# EAGLE design ict_v361-xs (EAGLE 9.6.2)
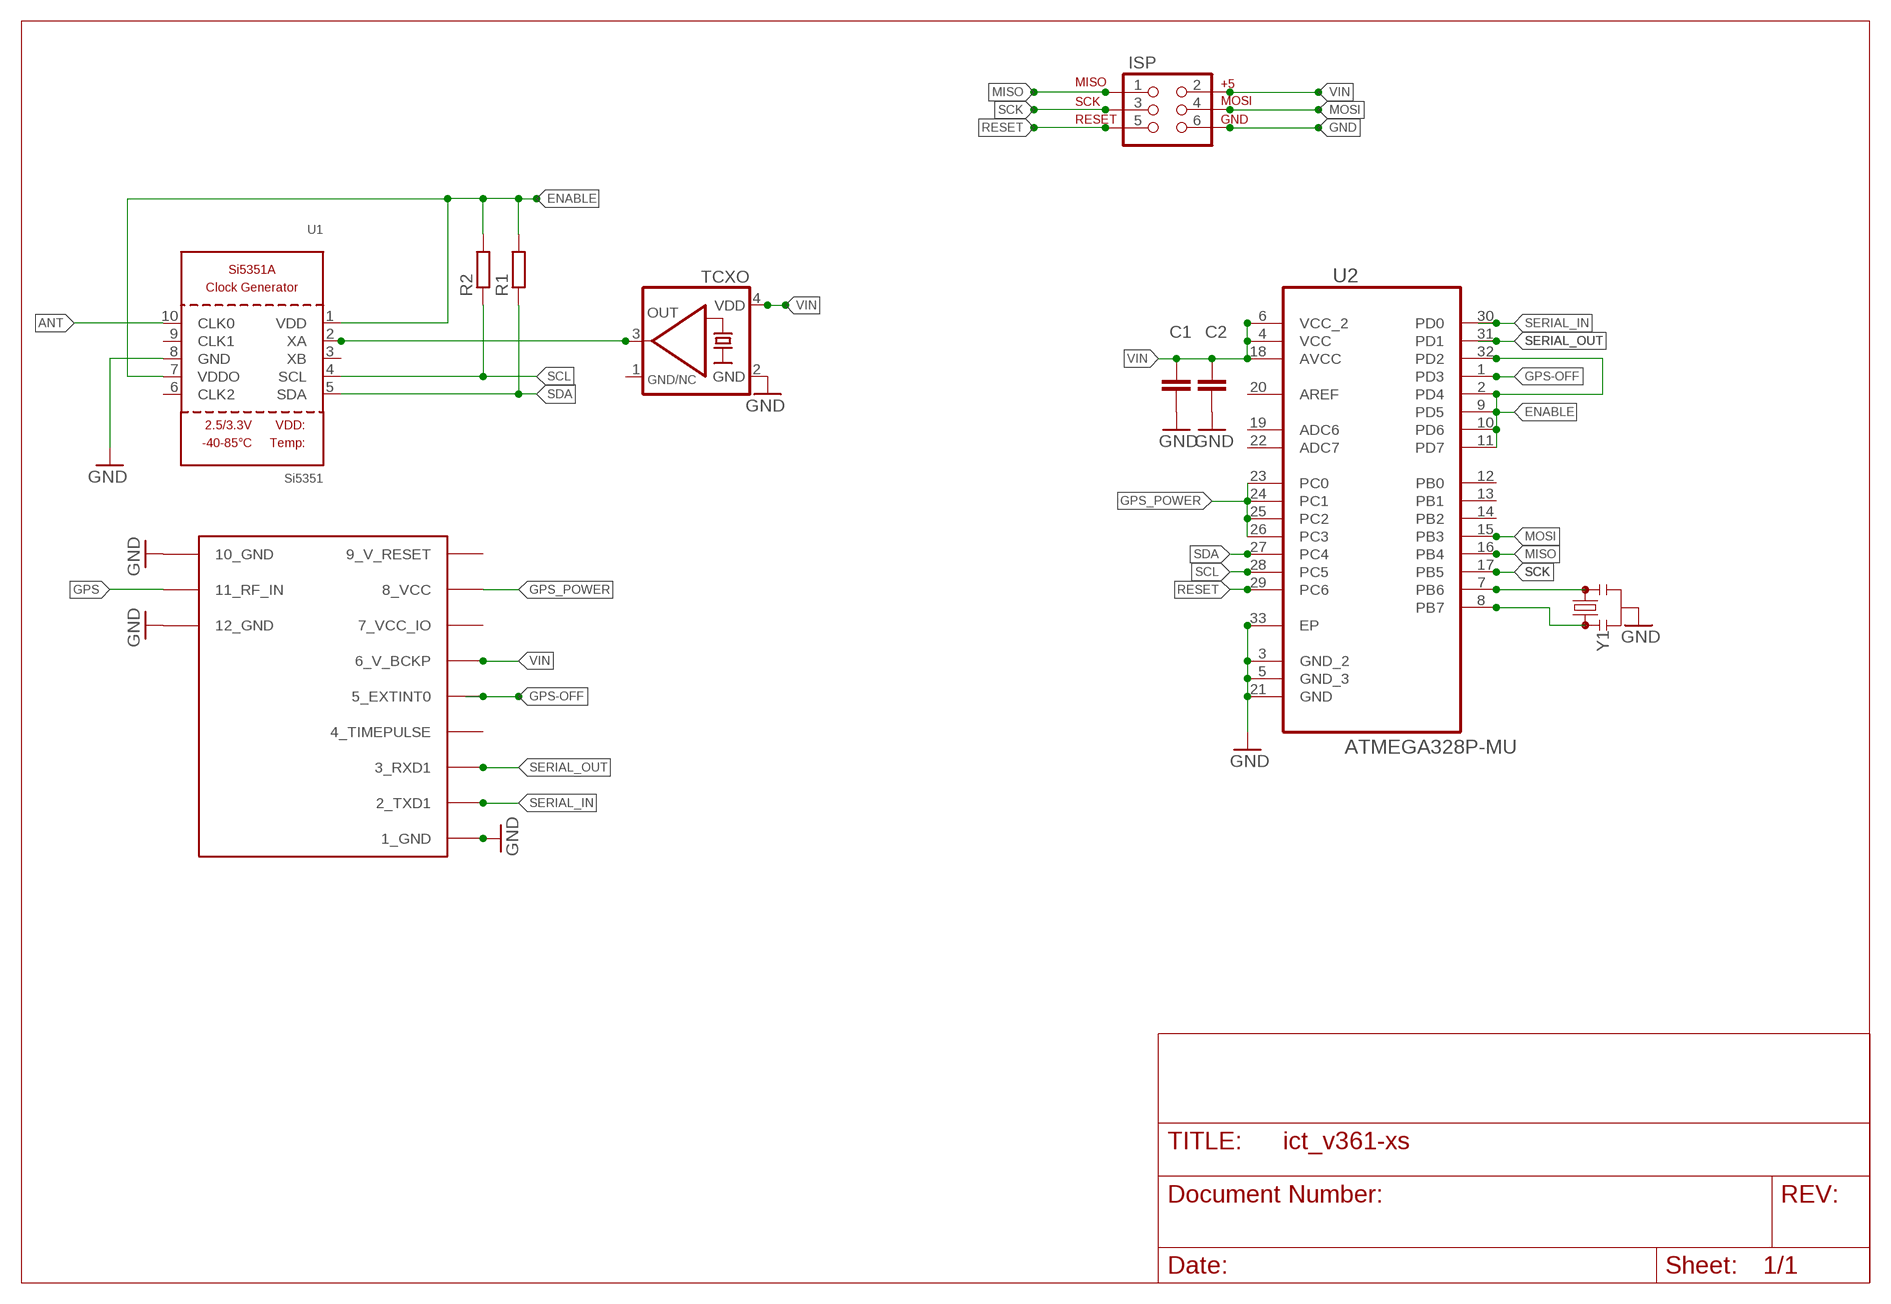
[diagram p0: schematic, sheet 1]

## Parts
C1  C-EUC0603K  [C0603K]
C2  C-EUC0603K  [C0603K]
GPS  UBLOX_MAX  [UBLOX_MAX]
ISP  AVR_SPI_PRG_6PTH  [2X3]
R1  R-EU_R0603  [R0603]
R2  R-EU_R0603  [R0603]
TCXO  KXO-TCXO-CMOS-84  [3.2X2.5_KXO-84-TCXO]
U1  Si5351  SI5351A  [MSOP10]
U2  ATMEGA328P-MU  [QFN50P500X500X100-33N]
Y1  RESONATORSMD-4.5X2.0  [RESONATOR-SMD-4.5X2.0]

## Nets
ANT: U1.10(CLK0)
ENABLE: R1.2 R2.2 U1.1(VDD) U1.7(VDDO) U2.2(PD4) U2.9(PD5) U2.10(PD6) U2.11(PD7) U2.32(PD2)
GND: C1.2 C2.2 GPS.1_GND GPS.10_GND GPS.12_GND ISP.6 TCXO.2(GND) U1.8(GND) U2.3(GND_2) U2.5(GND_3) U2.21(GND) U2.33(EP) Y1.2
GPS: GPS.11_RF_IN
GPS-OFF: GPS.5_EXTINT0 U2.1(PD3)
GPS_POWER: GPS.8_VCC U2.23(PC0) U2.24(PC1) U2.25(PC2) U2.26(PC3)
MISO: ISP.1 U2.16(PB4)
MOSI: ISP.4 U2.15(PB3)
N$1: U2.7(PB6) Y1.3
N$3: U2.8(PB7) Y1.1
N$19: TCXO.3(OUT) U1.2(XA)
RESET: ISP.5 U2.29(PC6)
SCK: ISP.3 U2.17(PB5)
SCL: R2.1 U1.4(SCL) U2.28(PC5)
SDA: R1.1 U1.5(SDA) U2.27(PC4)
SERIAL_IN: GPS.2_TXD1 U2.30(PD0)
SERIAL_OUT: GPS.3_RXD1 U2.31(PD1)
VIN: C1.1 C2.1 GPS.6_V_BCKP ISP.2 TCXO.4(VDD) U2.4(VCC) U2.6(VCC_2) U2.18(AVCC)
Unconnected: GPS.4_TIMEPULSE U1.3(XB) U1.6(CLK2) U1.9(CLK1) U2.12(PB0) U2.13(PB1) U2.14(PB2) U2.19(ADC6) U2.20(AREF) U2.22(ADC7)

## Power pins joined to a net without a drawn wire
7_VCC_IO: GPS.7_VCC_IO
9_V_RESET: GPS.9_V_RESET
GND/NC: TCXO.1(GND/NC)

## Library data of the parts
C1 C2 = rcl:C-EU: CAPACITOR, European symbol; SPICEPREFIX: C
GPS = Max gps:UBLOX_MAX: UBLOX MAX
ISP = SparkFun:AVR_SPI_PRG_6: AVR ISP 6 Pin This is the reduced ISP connector for AVR programming. Common on Arduino. This footprint will take up less PCB space and can be used with a 10-pin to 6-pin adapter such as SKU: BOB-08508
R1 R2 = resistor:R-EU_: RESISTOR, European symbol
TCXO = crystal-geyer_V1_0:KXO-TCXO-CMOS: TCXO : CMOS - Serie Model Size l/w/h [mm] Frequency Range Frequency Stability Temp. Range [°C] Output AECQ 200 availabel Datasheet KXO-86 KXO-84 KXO-83 KXO-82 2.5/2.0/0.7 3.2/2.5/1.0 5.0/3.2/1.5 7.0/5.0/2.4 13,0 ~ 40,0 MHz 10,0 ~ 40,0 MHz 10,0 ~ 40,0 MHz 10,0 ~ 30,0 MHz ±1,0 … ±2,5ppm ±1,0 … ±2,5ppm ±1,0 … ±3,0ppm ±1,0 … ±3,0ppm (*) -30°C …+75°C (*) -40°C …+85°C (*) -40°C …+85°C (*) -30°C …+80°C CMOS CMOS CMOS CMOS - - - - KXO-86.pdf <http://www.geyer-electronic.de/uploads/tx_userartikelfrequenz/GEYER-KXO-86-TCXO-HCMOS.pdf> KXO-84.pdf <http://www.geyer-electronic.de/uploads/tx_userartikelfrequenz/GEYER-KXO-84-TCXO-HCMOS.pdf> KXO-83.pdf <http://www.geyer-electronic.de/uploads/tx_userartikelfrequenz/GEYER-KXO-83-TCXO-HCMOS.pdf> KXO-82.pdf <http://www.geyer-electronic.de/uploads/tx_userartikelfrequenz/GEYER-KXO-82-TCXO-HCMOS.pdf> <http://www.geyer-electronic.de/fileadmin/template/img/logo-geyer-electronic.png> Details see: http://www.geyer-electronic.de/Frequenz-Produkte.9.0.html Created 2016-06-07, Hans Locher 2016 (C) Geyer Quartz Technology KXO86,KXO84,KXO83,KXO82;2550;3225;5032;7050;2,5x2,0;3,2x2,5;2.5x2.0;3.2x2.5,5,0x3,2;7,0x5,0,5.0x3.2,7.0x5.0
U1 = microbuilder:SI5351A: Si5351A 8kHz-160MHz I2C Clock Generator VDD: 2.5V or 3.3V Input Range: 25MHz or 27MHz XTAL User selectable internal input load capacitors: 6, 8 or 10 pF Output Impedance: 85 Ohm Output Load Capacitance: 5-15pF Operating Temperature: -40°C - 85°C Operating Current (3 outputs): 35mA Output buffer voltage (VDDO): 1.8, 2.5 or 3.3V Note: If VDDO is not used it should be connected to VDD. Unused clock out pins should be left floating.
U2 = ava:ATMEGA328P-MU: Programmable Flash; MPN: ATMEGA328P-MU; OC_FARNELL: 1748522; OC_NEWARK: 26R2526; PACKAGE: QFN-32; SUPPLIER: Atmel
Y1 = SparkFun-Clocks:RESONATOR: Resonators (Generic) Ceramic resonators are clock-generating components, often used to control timing in microcontrollers. They usually have 3 pins: two pins for oscillation, and one pin for ground. Compared to crystals, resonators have worse tolerance, but are usually much cheaper. Plus, they have built-in load capacitors! These devices are used on boards like the Arduino Pro 8MHz <https://www.sparkfun.com/products/11114> and Arduino Pro 16MHz <https://www.sparkfun.com/products/11113>.

## Net classes
0 default: width 0.203 mm
1 vcc: width 0.152 mm, clearance 0.152 mm

## Board
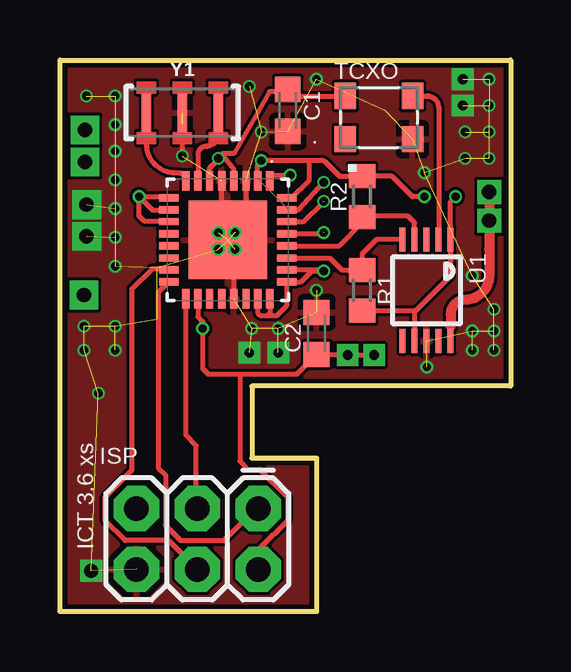
[diagram p1: board, top side]
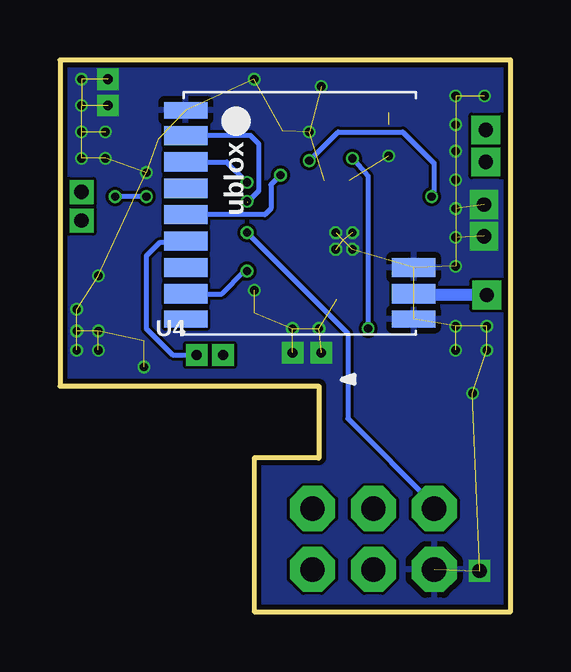
[diagram p2: board, bottom side, seen from below]

Size 18.8 x 23 mm. Coordinates in mm from the lower left corner, seen from the top.
Outline: 0,23 18.8,23 18.8,9.4 8,9.4 8,6.4 10.7,6.4 10.7,0 0,0 0,23
Copper layers (1*16): Top 0.035559375mm / dielectric 1.6mm / Bottom 0.035559375mm
Design rules "jlcpcb2layer *": minimum track width 5mil, minimum drill 12mil, track to track 5mil, track to pad 5mil, pad to pad 5mil, via to via 5mil, smd to smd 5mil, copper to edge 8mil, drill to drill 6mil, minimum pad ring 5mil, minimum via ring 3mil, stop-mask expansion 2.5mil, vias tented up to drill 14mil, thermal gap 10mil

### Footprints (pad centres in the part's own frame; a part is rotated, then mirrored left to right if it is on the bottom)
C0603K = smd 1.05 x 1.08: 1 -0.875,0; 2 0.875,0
UBLOX_MAX = smd 1.8 x 0.7: 1_GND 4.95,-4.4; 9_V_RESET 4.95,4.3; 10_GND -4.55,4.3 | smd 1.8 x 0.8: 2_TXD1 4.95,-3.35; 3_RXD1 4.95,-2.25; 4_TIMEPULSE 4.95,-1.15; 5_EXTINT0 4.95,-0.05; 6_V_BCKP 4.95,1.05; 7_VCC_IO 4.95,2.15; 8_VCC 4.95,3.25; 11_RF_IN -4.55,3.25; 12_GND -4.55,2.15
2X3 = drill 1.016 pad 1.88 octagon: 1 0,0; 2 0,2.54; 3 2.54,0; 4 2.54,2.54; 5 5.08,0; 6 5.08,2.54
R0603 = smd 1 x 1.1: 1 -0.85,0; 2 0.85,0
3.2X2.5_KXO-84-TCXO = smd 0.9 x 1.1: 1 -1.4,-0.9; 2 1.4,-0.9; 3 1.4,0.9; 4 -1.4,0.9
MSOP10 = smd 0.25 x 1: 1 -1,-2.113; 2 -0.5,-2.113; 3 0,-2.113; 4 0.5,-2.113; 5 1,-2.113; 6 1,2.113; 7 0.5,2.113; 8 0,2.113; 9 -0.5,2.113; 10 -1,2.113
QFN50P500X500X100-33N = smd 0.813 x 0.305: 1 -2.464,1.753; 2 -2.464,1.245; 3 -2.464,0.762; 4 -2.464,0.254; 5 -2.464,-0.254; 6 -2.464,-0.762; 7 -2.464,-1.245; 8 -2.464,-1.753; 17 2.464,-1.753; 18 2.464,-1.245; 19 2.464,-0.762; 20 2.464,-0.254; 21 2.464,0.254; 22 2.464,0.762; 23 2.464,1.245; 24 2.464,1.753 | smd 0.305 x 0.813: 9 -1.753,-2.464; 10 -1.245,-2.464; 11 -0.762,-2.464; 12 -0.254,-2.464; 13 0.254,-2.464; 14 0.762,-2.464; 15 1.245,-2.464; 16 1.753,-2.464; 25 1.753,2.464; 26 1.245,2.464; 27 0.762,2.464; 28 0.254,2.464; 29 -0.254,2.464; 30 -0.762,2.464; 31 -1.245,2.464; 32 -1.753,2.464 | smd 3.251 x 3.251: 33 0,0
RESONATOR-SMD-4.5X2.0 = smd 0.4 x 1.6: 1 -1.5,0; 2 0,0; 3 1.5,0

### Placement (x,y rotation side)
C1  9.5,20.9 270 top
C2  10.7,11.6 90 top
GPS  8.6,16.5 180 bottom
ISP  8.27,4.29 180 top
R1  12.6,13.4 270 top
R2  12.6,17.3 90 top
TCXO  13.3,20.6 0 top
U1  15.29,13.4 180 top
U2  7,15.5 270 top
Y1  5.1,20.8 0 top

### Tracks (layer width: path | path; a pad name or v marks a point on that pad's centre or on a via)
ANT  (via drill 0.6 pad 1)
  Top 0.203: 16.3,11.9 16.29,11.89 U1.10
  Top 0.406: 16.3,11.9 16.3,12.4 arc-90 16.9,13 arc90 17.9,14 17.9,15.1 v17.9,16.3 v17.9,17.5
ENABLE  (via drill 0.35)
  Top 0.203: 14.79,12.49 U1.7 14.8,11.03 | 14.79,12.49 16.29,13.99 U1.1 16.29,17.09 v16.5,17.3 | R1.2 14.73,12.55 14.79,12.49 | 10.4,18.8 11,18.8 11.65,18.15 R2.2 13.85,18.15 14.7,17.3 v15.2,17.3 | 10.4,18.8 v8.4,18.8 8.25,18.64 U2.2 | U2.32 9.65,17.25 10.4,18 10.4,18.8 | v3.3,17.3 4.49,17.3 U2.9 | v3.3,17.3 3.86,16.75 U2.10 | v3.3,17.3 3.3,16.5 3.54,16.26 U2.11
  Bottom 0.203: v15.2,17.3 v16.5,17.3 | v8.4,18.8 7.2,20 4.5,20 3.2,18.7 3.2,17.4 v3.3,17.3
GND  (via drill 0.35, 0.4 pad 0.9, 0.6 pad 0.7, 0.6 pad 1.2)  (54 unrouted)
  Top 0.203: 7.8,17.93 U2.3 7.76,16.26 U2.33 | 5.1,20.3 v5.1,19 | U2.21 7.25,15.25 U2.33 | U2.5 6.75,15.75 U2.33
  other vias: 2.3,19.2 15.3,10.2 18.1,10.9 1.11,16.97 1.11,15.65 1.1,21.5 10.7,13.4 2.3,10.9 2.3,14.4 2.3,15.6 7.9,10.8 2.3,11.9 2.3,16.8 2.3,18 9.1,10.8 2.3,20.3 2.3,21.5 1.6,9.1 1,11.9 1,10.9 8,11.8 9.1,11.8 7.3,15.8 6.6,15.8 6.6,15.1 7.3,15.1 17.9,18.9 17.9,20 17.9,21.1 16.9,20 16.9,18.9 10.7,22.2 17.9,22.2 18.1,12.6 18.1,11.7 17.2,10.9 7.9,21.9 1.3,1.7 15.2,18.3 8.4,20 17.2,14 17.2,11.7 16.8,22.2 16.8,21.1
  pour Top: -5.29,25.42 37.55,25.42 37.55,-3.69 -5.39,-3.69 -5.39,25.32
  pour Bottom: -5.39,25.42 37.55,25.42 37.55,-3.69 -5.39,-3.69
GPS  (via drill 0.6 pad 1.2)
  Bottom 0.203: 4,13.2 GPS.11_RF_IN
  Bottom 0.508: v1,13.2 4,13.2
GPS-OFF  (via drill 0.35)
  Top 0.203: U2.1 8.75,18.06 8.89,18.2 v9.6,18.2
  Bottom 0.203: v9.6,18.2 10,17.8 10,16.8 10.25,16.55 GPS.5_EXTINT0
GPS_POWER  (via drill 0.35)
  Top 0.203: 8.79,13 U2.24 8.75,12.45 8.65,12.35 | 9.56,14.25 U2.26 10.95,14.25 v11,14.2 10.5,14.2 10.05,13.75 U2.25 9.46,12.76 9.05,12.35 8.65,12.35 | U2.23 8.25,12.45 8.35,12.35 8.65,12.35
  Bottom 0.203: GPS.8_VCC 12.05,13.25 11.1,14.2 v11,14.2
MISO
  Top 0.203: ISP.1 8.16,4.29 6.84,2.96 5.04,2.96 4.4,3.6 4.4,5.7 4.1,6 4.1,13.31 U2.16
MOSI
  Top 0.203: U2.15 4.47,14.26 | 4.63,14.29 U2.15 | U2.15 4.5,14.29 3.83,14.29 3,13.46 3,5.9 1.89,4.78 1.89,3.79 2.71,2.96 4.53,2.96 5.68,1.81 ISP.4
N$1
  Top 0.203: Y1.3 6.6,19.9 arc-90 6.1,19.4 arc90 5.76,19.05 U2.7
N$3
  Top 0.203: Y1.1 3.6,19.5 arc90 4.8,18.3 4.91,18.3 arc-90 U2.8
N$7  (via drill 0.6 pad 1.2)
  other vias: 1.04,20.08
N$8  (via drill 0.6 pad 1.2)
  other vias: 1.04,18.75
N$19
  Top 0.203: TCXO.3 15.3,21.5 arc-90 15.8,21 15.8,15.52 arc-90 U1.2
RESET  (via drill 0.35)  (1 unrouted)
  Top 0.203: v11,15.8 10.95,15.75 U2.29
  Bottom 0.203: v11,15.8 6.8,11.6 6.8,8.04 3.21,4.45 ISP.5
SCK
  Top 0.203: 5.29,13.04 U2.17 5.25,7.36 5.68,6.93 5.68,4.45 ISP.3
SCL
  Top 0.203: U2.28 11.65,15.25 12.6,16.2 R2.1 12.65,16.5 14.5,16.5 14.79,16.21 U1.4
SDA
  Top 0.203: U1.5 13.2,15.51 12.6,14.91 R1.1 11.75,14.25 11.26,14.74 U2.27
SERIAL_IN  (via drill 0.35)  (1 unrouted)
  Top 0.203: U2.30 10.16,16.26 v11,17.1
  Bottom 0.203: GPS.2_TXD1 10.85,19.85 10.5,19.5 10.5,17.55 10.98,17.07
SERIAL_OUT  (via drill 0.35)
  Top 0.203: U2.31 9.95,16.75 v11,17.9
  Bottom 0.203: v11,17.9 11.85,18.75 GPS.3_RXD1
VIN  (via drill 0.35, 0.4 pad 0.9)
  Top 0.203: U2.18 5.76,12.29 5.95,12.1 v5.95,11.8 5.95,10.13 6.18,9.9 7.5,9.9 | 7.5,9.9 9.88,9.9 C2.1 11.98,10.73 v12,10.7 v13.1,10.7 | U2.6 6.24,18.49 6.51,18.76 v6.6,18.9 | U2.4 7.25,18.45 6.82,19 6.7,19 arc-62 v6.6,18.9 | v6.6,18.9 6.8,19.1 7.25,19.1 8.73,21.68 9.4,21.68 C1.1 9.48,21.5 TCXO.4 | 7.5,9.9 7.5,6.27 7.83,5.94 8.33,5.94 9.48,4.78 9.48,3.79 8.33,2.63 8.33,1.81 ISP.2
  Bottom 0.203: v6.6,18.9 5.95,18.15 v5.95,11.8 | GPS.6_V_BCKP 13.62,15.38 14.64,15.38 15.2,14.82 15.2,11.8 14.1,10.7 v13.1,10.7

### Text on the board
tPlace: .
tNames: . | ICT 3.6 xs
bNames: U4